# Altium schematic sheet MQ_7.SchDoc
size A; SheetNumber: 1; SheetTotal: 3
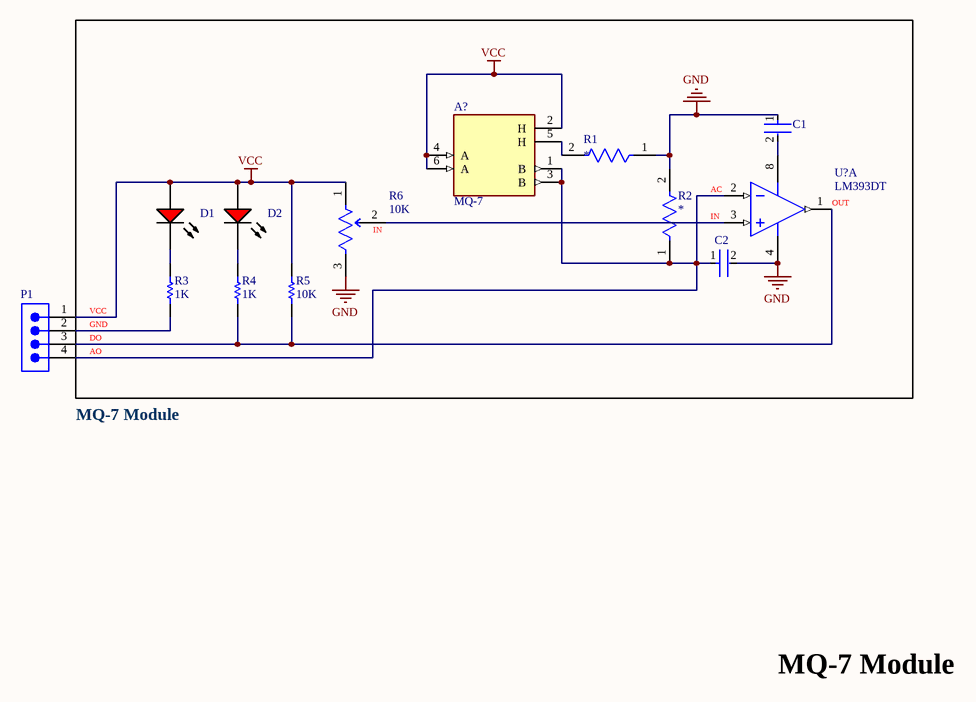
[diagram p0: MQ_7.SchDoc]

## Parts
A?  MQ-7  [XDCR_MQ-7]
C1  (no value)  [FP-C0402-BB-MFG]
C2  (no value)  [FP-C0402-BB-MFG]
D1  (no value)  [VISH-TLMX1100_V]
D2  (no value)  [VISH-TLMX1100_V]
P1  (no value)  [61300411121]
R1  *  [FP-AC0603-IPC_C]
R2  *  [FP-AC0603-IPC_C]
R3  1K  [RESC3116X65X40ML10T20]
R4  1K  [RESC3116X65X40ML10T20]
R5  10K  [RESC3116X65X40ML10T20]
R6  10K  [FP-3314J-1-MFG]
U?  LM393DT  [STM-SO-8_D_L]  (part A of 2)

## Nets
GND: C1.1 C2.2 R1.1 R2.2 R6.3(CW) U?.4(VCC-)
VCC: A?.2(H) A?.4(A) A?.6(A) D1.1(A) D2.1(A) P1.1 R5.2 R6.1(CCW)
NetA?_1: A?.1(B) A?.3(B) C2.1 P1.4 R2.1 U?.2(IN1-)
NetA?_5: A?.5(H) R1.2
NetC1_2: C1.2 U?.8(VCC+)
NetD1_2: D1.2(K) R3.2
NetD2_2: D2.2(K) R4.2
NetP1_2: P1.2 R3.1
NetP1_3: P1.3 R4.1 R5.1 U?.1(OUT1)
NetR6_2: R6.2(WIPER) U?.3(IN1+)

## Notes on the sheet
- AC
- (near R6) IN
- IN
- (near U?) OUT
- (near P1) GND
- (near P1) VCC
- (near P1) DO
- (near P1) AO
- MQ-7 Module

## Library data of the parts
A? = MQ-7: Gas Sensor, High sensitivity to carbon monoxide; MF: Hanwei Electronics Co., Ltd; SnapEDA_Link: https://www.snapeda.com/parts/MQ-7/Hanwei+Electronics+Co.%252C+Ltd/view-part/?ref=snap; Package: Package; Value: *; MP: MQ-7; Check_prices: https://www.snapeda.com/parts/MQ-7/Hanwei+Electronics+Co.%252C+Ltd/view-part/?ref=eda
C1 C2 = CMP-2008-02046-2: CAP CER 0.1UF 10V X5R 0402; Manufacturer: Kemet; Manufacturer Part Number: C0402C104K8PACTU; Material: Ceramic; Capacitance: 0.10 μF; Temperature Coefficient: 15%; Description: C0402 0.10 μF X5R 10.00% 10 V; Tolerance: 0.1; Value: 0.10 μF; Package: C0402-BB; Temperature: -55°C to +125°C; ComponentLink2Description: Datasheet; Temperature Characteristic: X5R; Device Class L1: Passive Components; Height: 0.55mm; Lead Free: Yes; ComponentLink2URL: https://content.kemet.com/datasheets/KEM_C1002_X7R_SMD.pdf; Device Class L2: Capacitors; Temperature Range Low: -55°C; Temperature Range High: +125°C; RoHS: TRUE; Octopart: https://octopart.com/c0402c104k8pactu-kemet-140039; Automotive: No; Mouser Description: Capacitor 100 nF 10 VDC 0402; Category: Cap; Voltage Rating: 10 V; Digikey Description: CAP CER 0.1UF 10V X5R 0402; Ipc Land Pattern Name: CAPC10050X50; Device Class L3: Ceramic Capacitors
D1 D2 = CMP-1666-00027-1: LED, RED, 2.1 V, -40 to 100 degC, 2-Pin SMD (0603), RoHS, Tape and Reel; Type (Capacitors): C0G; Resistance: 100000000000 Ohm; Capacitance: 12 pF; Voltage Rating: 50 V; Tolerance: 5%; Min Operating Temperature: -55degC; REACH SVHC: No SVHC; ComponentLink2Description: Datasheet; ComponentLink1URL: http://www.vishay.com/; Width: 0.8 mm; Package Quantity: 4000; PackageReference: TLMX1100; ComponentLink2URL: http://www.vishay.com/docs/83173/tlmb1100.pdf; Case/Package: 0603; Case Code (Metric): 1608; Packaging: Tape and Reel; Pins: 2; ComponentLink1Description: Manufacturer URL; Max Operating Temperature: 125degC; Height: 0.8 mm; Length: 1.6 mm; Mount: Surface Mount; PackageDescription: 2-Pin Surface Mount Device, Body 1.6 x 0.8 mm; DatasheetVersion: Rev. 2.7, 03/2016; Case Code (Imperial): 0603; Voltage Rating (DC): 50 V; RoHSCompliant: True; Radiation Hardening: No
P1 = CMP-1502-01064-3: NexarPartId: 32855522; Operating Supply Voltage: 250V; Pitch: 2.54mm; Contact Resistance: 20mΩ; Number of Positions: 4; Current Rating: 3A; Connector Type: Male Pin; Gender: Male; Contact Plating: Gold; Height: 8.89mm; Lead Pitch: 2.54mm; Lead Free: Lead Free; Contact Mating Length: 5.9944mm; Number of Rows: 1; Termination: Solder; Packaging: Bulk; REACH SVHC: Unknown; Min Operating Temperature: -40°C; RoHS: Compliant; Number of Contacts: 4; Voltage Rating: 250V; Color: Black; Max Operating Temperature: 105°C; Contact Material: Copper; Mount: Through Hole; Orientation: Vertical; Number of Pins: 4
R1 R2 = CMP-2000-04844-3: RES 47KΩ 1.00% 0.1W 0603; Tolerance: 1%; Max Power Dissipation: 100mW; Resistance: 47kR; Voltage Rating: 50V; Temperature Coefficient: 100ppm/°C; Radiation Hardening: No; Weight: 7.1E-05oz; Case Code (Imperial): 0603; RoHS Compliant: Yes; Features: Moisture Resistant; Packaging: Tape and Reel; Number of Terminations: 2; Termination: SMD/SMT; Construction: Rectangular; Military Standard: Not; Series: AC; Min Operating Temperature: -55°C; Power Rating: 100mW; Lead Free: Lead Free; Case Code (Metric): 1608; Length: 1.6mm; Max Operating Temperature: 155°C; Ratings: AEC-Q200; Width: 0.8mm; Depth: 0.8mm; Height: 0.45mm; Case/Package: 0603; Resistor Type: Thick Film; Contact Plating: Tin
R3-R5 = CMP-2100-03678-1: Chip Resistor, 1 KOhm, +/- 1%, 0.25 W, -55 to 155 degC, 1206 (3216 Metric), RoHS, Tape and Reel; Manufacturer: Yageo; Temperature Coefficient: 100ppm/degreesC; Power Rating: 250mW; Voltage Rating: 200V; Resistance: 1KOhm; Composition: ThickFilm; Min Operating Temperature: -55degC; Tolerance: 1%; REACH SVHC: Unknown; Case Code (Metric): 3216; Military Standard: Not; Datasheet Version: Rev. 5, 10/2016; Package Reference: 1206.0; Case/Package: 1206; Length: 3.1mm; Manufacturer URL: http://www.yageo.com/; Lead Free: LeadFree; RoHSCompliant: true; Termination: SMD/SMT; Packaging: TapeandReel; Package Description: 2-Pin Surface Mount Device, Body 3.1 x 1.6 mm; Depth: 1.6mm; Case Code (Imperial): 1206; Max Operating Temperature: 155degC; Datasheet URL: http://www.yageo.com/NewPortal/yageodocoutput?fileName=/pdf/R-Chip/PYu-RC_Group_51_RoHS_L_5.pdf; Height: 0.55mm
R6 = CMP-07234-000035-1: TRIMMER 10K OHM 0.25W J LEAD TOP; RoHS Compliant: Yes
U? = CMP-2000-06550-1: Low-Power, Dual-Voltage Comparator, 2 to 36 V, 0 to 70 degC, 8-Pin SOIC (SO), RoHS, Tape and Reel; Manufacturer: STMicroelectronics; Voltage - Supply, Single/Dual (±): 2V~36V,±1V~18V; Current - Input Bias (Max): 0.25µA@5V; Number of Elements: 2; Current - Output (Typ): 18mA@5V; Other Names: 497-1593-2; Voltage - Input Offset (Max): 5mV@30V; Output Type: CMOS,DTL,ECL,MOS,Open-Collector,TTL; EDA / CAD Models: DownloadfromAcceleratedDesigns; Other Related Documents: LM393ViewAllSpecificationsLM393ViewAllSpecifications; Online Catalog: Comparators-2elements; Current - Quiescent (Max): 2.5mA; Standard Package: 2,500; Manufacturer URL: http://www.st.com/; Package Description: 8-Pin Small Outline Integrated Circuit, Body 4.9 x 3.9 mm, Pitch 1.27 mm; Packaging: Tape&Reel(TR); Datasheet Version: Rev. 15, 02/2016; Category: IntegratedCircuits(ICs); Operating Temperature: 0°C~70°C; Mounting Type: SurfaceMount; Supplier Device Package: 8-SO; Datasheet URL: http://www.st.com/content/ccc/resource/technical/document/datasheet/group1/b4/cc/cf/13/18/28/44/f5/CD00000465/files/CD00000465.pdf/jcr:content/translations/en.CD00000465.pdf; Family: Linear-Comparators; Mounting Technology: SurfaceMount; Type: GeneralPurpose; Package Reference: SO-8; Package / Case: 8-SOIC(0.154",3.90mmWidth)